# Altium schematic sheet PCIe.SchDoc
size A4
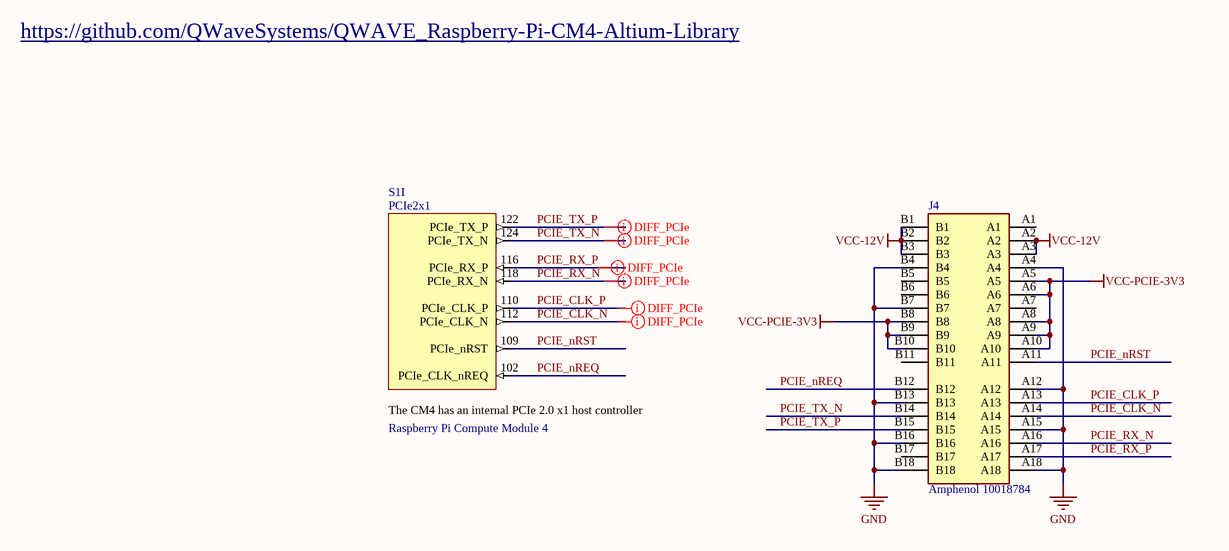
[diagram p0: PCIe.SchDoc]

## Parts
J4  Amphenol 10018784  [PCIE-1X-Connector]
S1  Raspberry Pi Compute Module 4  [CM4-F40C-100DS-0.4v_1.5mm_0mm]  (part I of 21)

## Nets
GND: J4.A4 J4.A12 J4.A15 J4.A18 J4.B4 J4.B7 J4.B13 J4.B16 J4.B18
VCC-12V: J4.A2 J4.A3 J4.B1 J4.B2 J4.B3
VCC-PCIE-3V3: J4.A5 J4.A6 J4.A8 J4.A9 J4.A10 J4.B8 J4.B9 J4.B10
PCIE_CLK_N: J4.A14 S1.112(PCIe_CLK_N)
PCIE_CLK_P: J4.A13 S1.110(PCIe_CLK_P)
PCIE_nREQ: J4.B12 S1.102(PCIe_CLK_nREQ)
PCIE_nRST: J4.A11 S1.109(PCIe_nRST)
PCIE_RX_N: J4.A16 S1.118(PCIe_RX_N)
PCIE_RX_P: J4.A17 S1.116(PCIe_RX_P)
PCIE_TX_N: J4.B14 S1.124(PCIe_TX_N)
PCIE_TX_P: J4.B15 S1.122(PCIe_TX_P)

Not connected (* = marked no-connect by the designer): J4 A1 A7 B5 B6 B11 B17

## Layout directives
differential pair; differential pair class DIFF_90Ohm_PCIe; differential pair class DIFF_PCIe; net class PCIe_5Gbps: PCIE_CLK_N, PCIE_CLK_P, PCIE_RX_N, PCIE_RX_P, PCIE_TX_N, PCIE_TX_P

## Notes on the sheet
- https://github.com/QWaveSystems/QWAVE_Raspberry-Pi-CM4-Altium-Library
- Title
- Size:
- Date:
- A4
- Number:
- Time:
- Revision:
- Sheet
- of
- Q-Wave Systems Co.,Ltd
- 65/2 Moo 1 Beung
- Sriracha Chonburi
- Thailand
- File:
- (in symbol CM4, part I) PCIe2x1; The CM4 has an internal PCIe 2.0 x1 host controller

## Library data of the parts
J4 = PCIE-1X-Connector: 36 Position Female Connector Amphenol 10018784-10210TLF; MF: Amphenol ICC; Price: None; SnapEDA_Link: https://www.snapeda.com/parts/10018784-10210TLF/Amphenol%20FCI/view-part/520950/?ref=snap; Availability: Unavailable; MP: 10018784-10210TLF; Package: None; Value: *
S1 = CM4: Raspberry Pi Compute Module 4 by Amornthep Phunsin